# EAGLE design DoorBellRepeater (EAGLE 9.6.2)
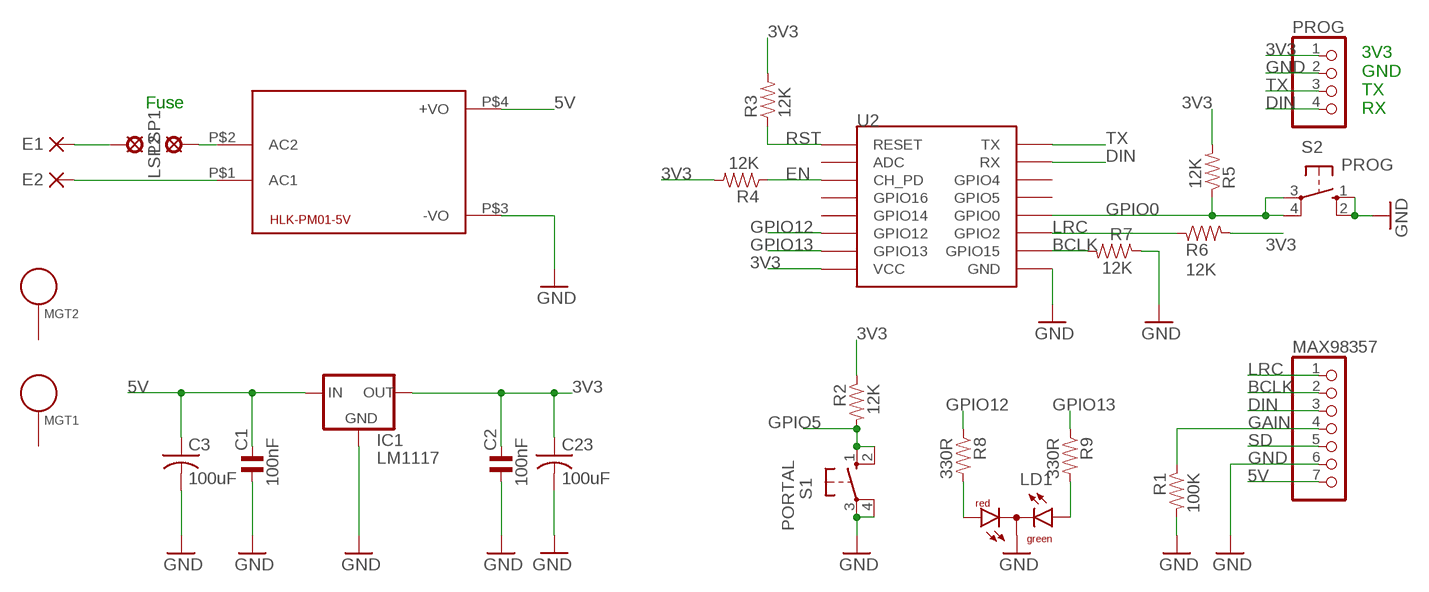
[diagram p0: schematic, sheet 1]

## Parts
C1  100nF  C_0805MP  [C0805MP]
C2  100nF  C_0805MP  [C0805MP]
C3  100uF  C-USC0805K  [C0805K]
C23  100uF  C-USC0805K  [C0805K]
E1  PAD-0460S-S  [0460S-S]
E2  PAD-0460S-S  [0460S-S]
HLK-PM01-5V  HLK-PM013W  [HLK-PM01]
IC1  LM1117  [SOT223]
LD1  DUOLED-RG-C  [DUOLED-C-5MM]
LSP1  LSP10  [LSP10]
LSP2  LSP10  [LSP10]
MAX98357  PINHD-1X7  [1X07]
MGT1  MOUNTING_HOLE  [BEAGLEBONEBLACK_MOUNTING_HOLE]
MGT2  MOUNTING_HOLE  [BEAGLEBONEBLACK_MOUNTING_HOLE]
PROG  PINHD-1X4  [1X04]
R1  100K  RESISTOR0805_RES  [0805_RES]
R2  12K  RESISTOR0805_RES  [0805_RES]
R3  12K  RESISTOR0805_RES  [0805_RES]
R4  12K  RESISTOR0805_RES  [0805_RES]
R5  12K  RESISTOR0805_RES  [0805_RES]
R6  12K  RESISTOR0805_RES  [0805_RES]
R7  12K  RESISTOR0805_RES  [0805_RES]
R8  330R  RESISTOR0805_RES  [0805_RES]
R9  330R  RESISTOR0805_RES  [0805_RES]
S1  PORTAL  10-XX  [B3F-10XX]
S2  PROG  10-XX  [B3F-10XX]
U2  ESP12  [ESP12]

## Nets
3V3: C2.2 C23.1 IC1.2(OUT) PROG.1 R2.1 R3.2 R4.2 R5.2 R6.2 U2.VCC
5V: C1.2 C3.1 HLK-PM01-5V.P$4(+VO) IC1.3(IN) MAX98357.7
BCLK: MAX98357.2 R7.2 U2.GPIO15
DIN: MAX98357.3 PROG.4 U2.RX
EN: R4.1 U2.CH_PD
GAIN: MAX98357.4 R1.1
GND: C1.1 C2.1 C3.2 C23.2 HLK-PM01-5V.P$3(-VO) IC1.1(GND) LD1.C MAX98357.6 PROG.2 R1.2 R7.1 S1.3(P) S1.4(P1) S2.1(S) S2.2(S1) U2.GND
GPIO0: R5.1 S2.3(P) S2.4(P1) U2.GPIO0
GPIO5: R2.2 S1.1(S) S1.2(S1)
GPIO12: R8.1 U2.GPIO12
GPIO13: R9.1 U2.GPIO13
LRC: MAX98357.1 R6.1 U2.GPIO2
N$1: E2.1(P) HLK-PM01-5V.P$1(AC1)
N$2: HLK-PM01-5V.P$2(AC2) LSP1.MP
N$4: LD1.AR R8.2
N$5: LD1.AX(AG) R9.2
N$6: E1.1(P) LSP2.MP
RST: R3.1 U2.RESET
SD: MAX98357.5
TX: PROG.3 U2.TX
Unconnected: MGT1.P$1 MGT2.P$1 U2.ADC U2.GPIO4 U2.GPIO5 U2.GPIO14 U2.GPIO16

## Notes on the sheet
- Fuse
- 3V3
  GND
  TX
  RX

## Library data of the parts
C1 C2 = rc-master-smd:C_: NON-POLARIZED CAP
C3 C23 = adafruit:C-US: CAPACITOR, American symbol
E1 E2 = dpads:PAD: WIRE PAD Standard US Drill Sizes and SMD pads; BOM: EXCLUDE
HLK-PM01-5V = HLK-PM01:HLK-PM01: Hi-Link Power Supply HLK-PM01 3W Author: Ahmed Said <https://github.com/AhmedSaid/EAGLELibraries>
IC1 = v-reg-3:LM1117
LD1 = led:DUOLED-RG-C: DUO LED 2 colors (red/green), 5 mm, round, common Cathode www.ligitek.com or other producers.
LSP1 LSP2 = solpad:LSP10: SOLDER PAD drill 1.0 mm, distributor Buerklin, 12H555
MAX98357 = pinhead:PINHD-1X7: PIN HEADER
MGT1 MGT2 = BeagleBone_Blue_R3:MOUNTING_HOLE: Chassis Mounting Hole w/GND connection ability
PROG = pinhead:PINHD-1X4: PIN HEADER
R1-R9 = passives:RESISTOR: Resistor Basic schematic elements and footprints for 0603, 1206, and PTH resistors.
S1 S2 = switch-omron:10-XX: OMRON SWITCH; MPN: B3F-1000; OC_FARNELL: 176432; OC_NEWARK: 36M3542
U2 = esp8266modules:ESP12: ESP8266 Wifi module 12

## Board
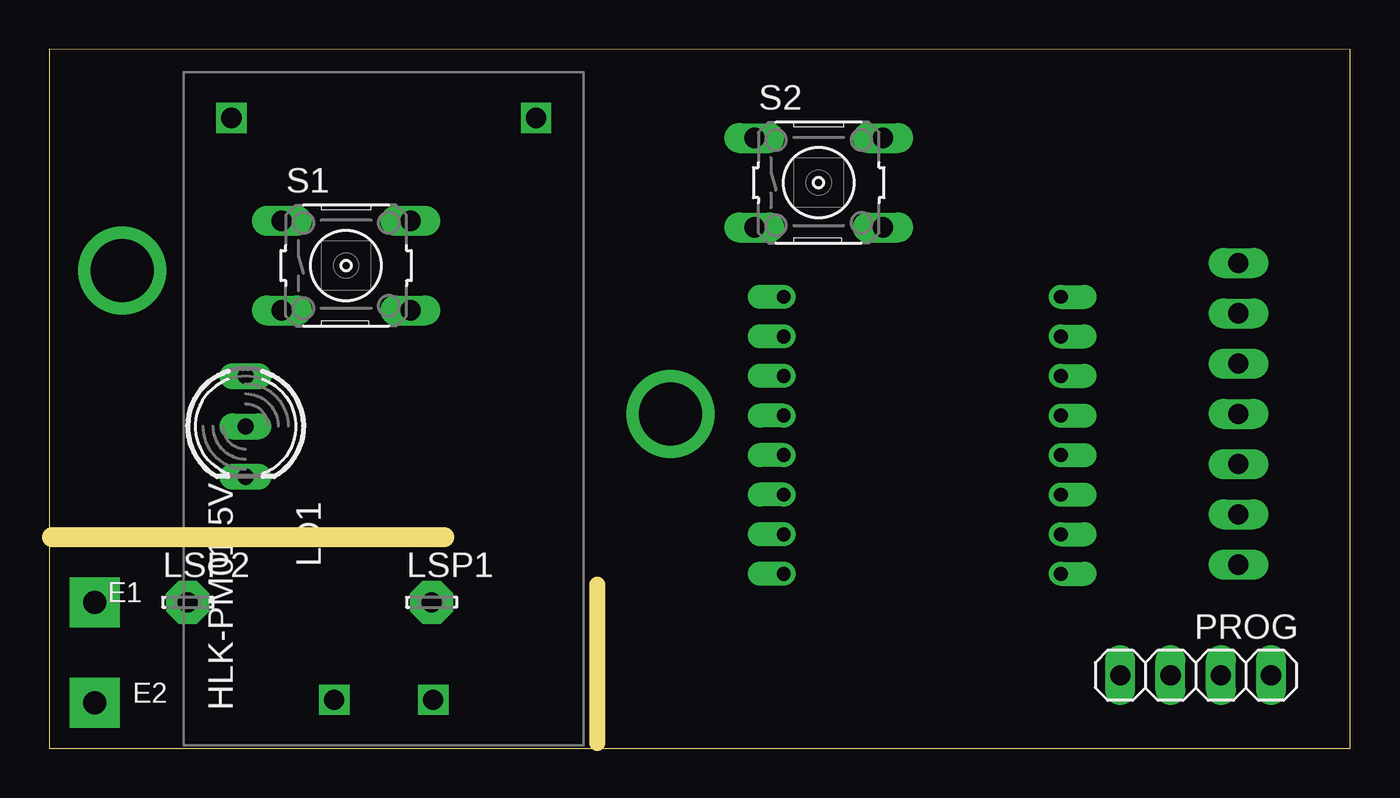
[diagram p1: board, top side]
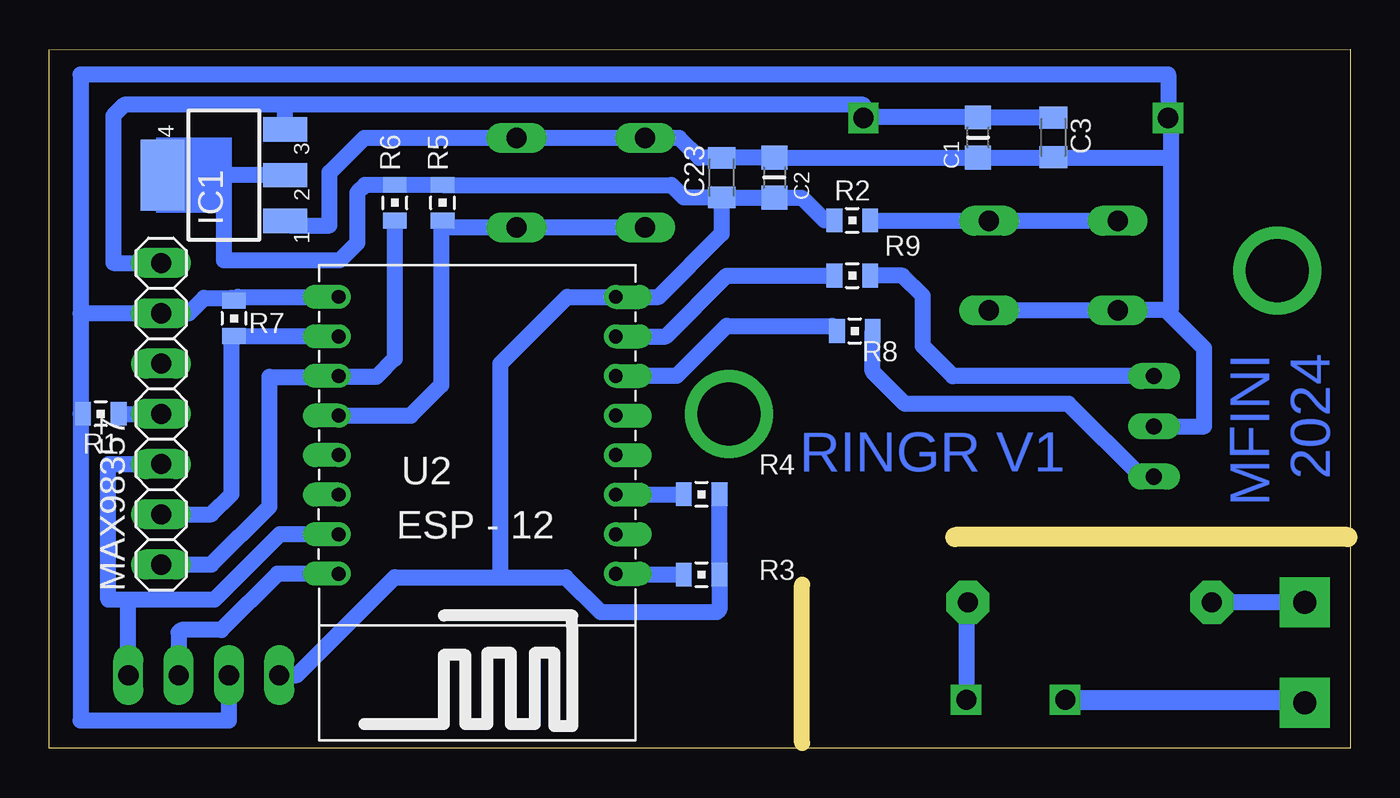
[diagram p2: board, bottom side, seen from below]

Size 65.71 x 35.31 mm. Coordinates in mm from the lower left corner, seen from the top.
Outline: 0,0 65.71,0 65.71,35.3 0,35.31 0,0
Copper layers (1*16): Top 0.035mm / dielectric 1.5mm / Bottom 0.035mm
Design rules "default *": minimum track width 6mil, minimum drill 0.35mm, track to track 12mil, track to pad 12mil, pad to pad 12mil, via to via 12mil, smd to smd 12mil, copper to edge 40mil, drill to drill 6mil, minimum pad ring 10mil, minimum via ring 8mil, stop-mask expansion 4mil, vias tented up to drill 0mil, thermal gap 10mil
Milling: 2 lines

### Footprints (pad centres in the part's own frame; a part is rotated, then mirrored left to right if it is on the bottom)
C0805MP = smd 1.2 x 1.3: 1 -1.016,0; 2 1.016,0
C0805K = smd 1.1 x 1.4: 1 -1,0; 2 1,0
0460S-S = drill 1.168 pad 2.54 square: 1 0,0
HLK-PM01 = drill 1.016 square: P$1 -14.7,2.5; P$2 -14.7,-2.5; P$3 14.7,7.7; P$4 14.7,-7.7
SOT223 = smd 1.219 x 2.235: 1 -2.311,-3.099; 2 0,-3.099; 3 2.311,-3.099 | smd 3.6 x 2.2: 4 0,3.099
DUOLED-C-5MM = drill 0.813 long: AR 2.54,0; AX -2.54,0; C 0,0
LSP10 = drill 1.016 pad 2.159 octagon: MP 0,0
1X07 = drill 1.016 long: 1 -7.62,0; 2 -5.08,0; 3 -2.54,0; 4 0,0; 5 2.54,0; 6 5.08,0; 7 7.62,0
BEAGLEBONEBLACK_MOUNTING_HOLE = drill 3.175 pad 4.445: P$1 0,0
1X04 = drill 1.016 long: 1 -3.81,0; 2 -1.27,0; 3 1.27,0; 4 3.81,0
0805_RES = smd 0.8 x 1.2: 1 -0.9,0; 2 0.9,0
B3F-10XX = drill 1.016 long: 1 -3.251,2.261; 2 3.251,2.261; 3 -3.251,-2.261; 4 3.251,-2.261
ESP12 = drill 0.7 offset: ADC -7.1,3.8; CH_PD -7.1,1.8; GND 6.9,-8.2; GPIO0 6.9,-2.2; GPIO2 6.9,-4.2; GPIO4 6.9,1.8; GPIO5 6.9,-0.2; GPIO12 -7.1,-4.2; GPIO13 -7.1,-6.2; GPIO14 -7.1,-2.2; GPIO15 6.9,-6.2; GPIO16 -7.1,-0.2; RESET -7.1,5.8; RX 6.9,3.8; TX 6.9,5.8; VCC -7.1,-8.2

### Placement (x,y rotation side)
C1  18.8,30.86 90 bottom
C2  29.08,28.83 270 bottom
C3  14.99,30.86 270 bottom
C23  31.75,28.83 90 bottom
E1  2.29,7.37 0 top
E2  2.29,2.29 0 top
HLK-PM01-5V  16.89,17.14 90 top
IC1  56.9,28.96 90 bottom
LD1  9.91,16.26 270 top
LSP1  19.3,7.37 0 top
LSP2  6.99,7.37 0 top
MAX98357  60.07,16.89 90 bottom
MGT1  3.68,24.13 0 top
MGT2  31.37,16.89 0 top
PROG  57.91,3.68 0 top
R1  63.12,16.89 180 bottom
R2  25.15,26.67 0 bottom
R3  32.77,8.76 0 bottom
R4  32.77,12.83 0 bottom
R5  45.85,27.56 90 bottom
R6  48.26,27.56 90 bottom
R7  56.39,21.72 270 bottom
R8  25.02,21.08 0 bottom
R9  25.15,23.88 0 bottom
S1  14.99,24.38 0 top
S2  38.86,28.57 0 top
U2  44.2,14.61 180 bottom

### Tracks (layer width: path | path; a pad name or v marks a point on that pad's centre or on a via)
3V3
  Bottom 0.152: C23.1 32.25,28.33
  Bottom 0.406: R4.2 31.87,12.95
  Bottom 0.813: IC1.2 56.9,28.96 56.9,24.64 51.05,24.64 50.16,25.53 50.16,28.07 49.77,28.46 R6.2 R5.2 34.28,28.46 33.65,27.83 C23.1 | C23.1 31.73,27.81 C2.2 27.7,27.81 26.55,26.67 R2.1 | R4.2 R3.2 31.87,7 32,6.86 37.85,6.86 39.62,8.64 42.93,8.64 | 42.93,8.64 42.93,19.43 39.55,22.8 U2.VCC 34.94,22.8 31.75,25.99 C23.1 | PROG.1 53.21,3.68 48.26,8.64 42.93,8.64 | 31.87,27.95 C23.1
5V
  Bottom 0.152: HLK-PM01-5V.P$4 24.63,31.88
  Bottom 0.813: MAX98357.7 62.48,24.51 62.48,31.95 61.92,32.51 53.8,32.51 | IC1.3 53.8,32.51 | 53.8,32.51 24.59,32.51 24.59,31.88 | C3.1 18.78,31.86 C1.2 24.59,31.88 | HLK-PM01-5V.P$4 24.59,31.88
BCLK
  Bottom 0.813: MAX98357.2 57.53,11.81 56.52,12.83 56.52,20.69 R7.2 51.11,20.82 U2.GPIO15
DIN
  Bottom 0.406: 61.34,3.68 PROG.4 61.72,4.57
  Bottom 0.813: MAX98357.3 62.74,14.35 62.74,7.49 61.72,7.49 | U2.RX 54.07,10.8 57.38,7.49 61.72,7.49 | PROG.4 61.72,7.49
EN
  Bottom 0.813: U2.CH_PD 37.07,12.83 R4.1
GAIN
  Bottom 0.813: R1.1 MAX98357.4
GND
  Bottom 0.152: 31.73,29.84 C23.2
  Bottom 0.406: IC1.1 53.57,26.42
  Bottom 0.61: R7.1 56.2,22.8
  Bottom 0.813: S1.4 S1.3 11.71,22.14 9.32,22.14 | 64.14,21.97 MAX98357.6 58.67,21.97 57.9,22.74 56.52,22.74 R7.1 | 64.14,21.97 64.14,34.04 9.19,34.04 HLK-PM01-5V.P$3 9.06,31.72 9.06,29.84 | PROG.2 56.64,1.4 64.14,1.4 64.14,16.89 | 56.2,22.8 U2.GND | LD1.C 7.37,16.26 7.37,20.19 9.32,22.14 | S2.1 S2.2 49.81,30.84 51.56,29.08 51.56,26.42 53.57,26.42 | 64.03,16.89 R1.2 64.14,16.89 | 64.14,21.97 64.14,16.89 | 35.46,30.99 S2.1 | 9.06,29.84 9.06,22.14 9.32,22.14 | 9.06,29.84 14.97,29.84 C3.2 15,29.84 C1.1 18.82,29.82 29.06,29.82 C2.1 31.73,29.84 | C23.2 32.88,29.83 33.88,30.84 S2.1
GPIO0
  Bottom 0.152: U2.GPIO0 51.05,16.76
  Bottom 0.813: 51.14,16.76 U2.GPIO0 47.46,16.8 45.92,18.34 45.92,26.58 R5.1 45.5,26.31 S2.4 S2.3 35.57,26.28
GPIO5
  Bottom 0.813: R2.2 24.22,26.64 S1.2 S1.1
GPIO12
  Bottom 0.406: R8.1 26.17,21.34
  Bottom 0.813: U2.GPIO12 34.03,18.8 31.5,21.34 26.17,21.34
GPIO13
  Bottom 0.813: U2.GPIO13 34.57,20.8 31.5,23.88 R9.1
LRC
  Bottom 0.152: 51.1,18.8 U2.GPIO2 52.11,18.8 52.16,18.76
  Bottom 0.813: MAX98357.1 57.53,9.27 54.61,12.19 54.61,18.76 52.16,18.76 49.19,18.76 48.26,19.68 R6.1
N$1
  Bottom 1.016: HLK-PM01-5V.P$1 2.45,2.44 E2.1
N$2
  Bottom 0.813: LSP1.MP 19.39,7.28 HLK-PM01-5V.P$2
N$4
  Bottom 0.813: R8.2 24.12,19.04 22.48,17.4 14.22,17.4 10.54,13.72 LD1.AR
N$5
  Bottom 0.813: LD1.AX 20.07,18.8 21.59,20.32 21.59,22.86 22.61,23.88 R9.2
N$6
  Bottom 0.813: E1.1 LSP2.MP
RST
  Bottom 0.406: 37.05,8.76 U2.RESET
  Bottom 0.813: R3.1 37.05,8.76
TX
  Bottom 0.406: PROG.3 58.8,3.68
  Bottom 0.813: 59.18,3.81 PROG.3 59.18,5.84 59.05,5.97 57.02,5.97 54.19,8.8 U2.TX
(copper drawn outside any net)
  shapes: Bottom area x1

### Text on the board
Bottom: MFINI / 2024 | RINGR V1